# Altium schematic sheet IMX_Digital Interface Circuit.SchDoc
size A4; SheetNumber: 6; SheetTotal: 8
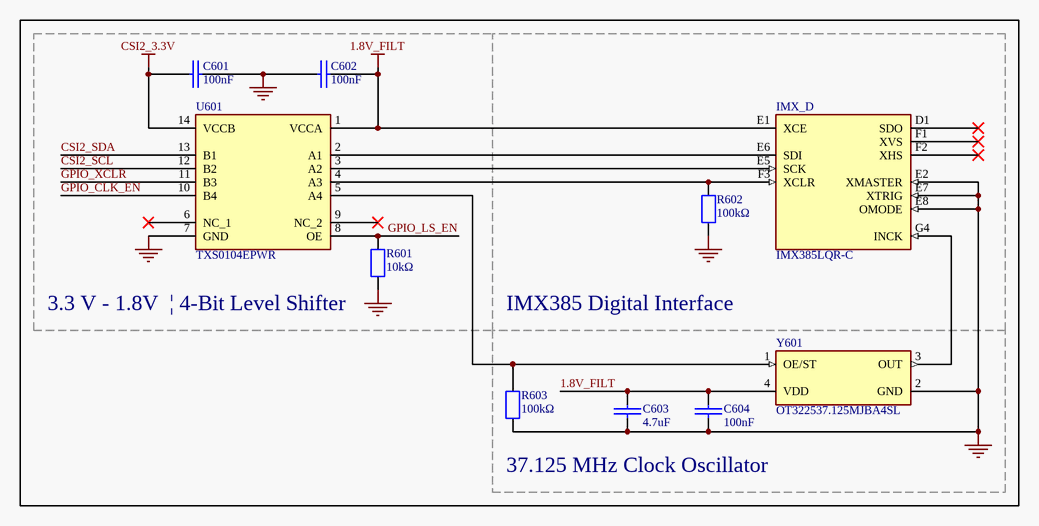
[diagram p0: IMX_Digital Interface Circuit.SchDoc]

## Parts
C601  100nF  [Capacitor, 0402]
C602  100nF  [Capacitor, 0402]
C603  4.7uF  [Capacitor, 0603]
C604  100nF  [Capacitor, 0402]
IMX_  IMX385LQR-C  [IMX385LQR]  (part D of 6)
R601  10kΩ  [Resistor, 0603, Yageo]
R602  100kΩ  [Resistor, 0603, Yageo]
R603  100kΩ  [Resistor, 0603, Yageo]
U601  TXS0104EPWR  [Level Shifter, 4-Bit]
Y601  OT322537.125MJBA4SL  [Clock Oscillator, 3235, 37.125]

## Nets
1.8V_FILT: C602.2 C603.1 C604.1 IMX_.E1(XCE) U601.1(VCCA) Y601.4(VDD)
CSI2_3.3V: C601.2 U601.14(VCCB)
GND: C601.1 C602.1 C603.2 C604.2 IMX_.E2(XMASTER) IMX_.E7(XTRIG) IMX_.E8(OMODE) R601.1 R602.1 R603.1 U601.7(GND) Y601.2(GND)
CSI2_SCL: U601.12(B2)
CSI2_SDA: U601.13(B1)
GPIO_CLK_EN: U601.10(B4)
GPIO_LS_EN: R601.2 U601.8(OE)
GPIO_XCLR: U601.11(B3)
NetIMX__E5: IMX_.E5(SCK) U601.3(A2)
NetIMX__E6: IMX_.E6(SDI) U601.2(A1)
NetIMX__F3: IMX_.F3(XCLR) R602.2 U601.4(A3)
NetIMX__G4: IMX_.G4(INCK) Y601.3(OUT)
NetR603_2: R603.2 U601.5(A4) Y601.1(OE/ST)

Not connected (* = marked no-connect by the designer): IMX_ D1(SDO)* F1(XVS)* F2(XHS)*; U601 6(NC_1)* 9(NC_2)*

## Notes on the sheet
- (near R601) 3.3 V - 1.8V  | 4-Bit Level Shifter
- IMX385 Digital Interface
- 37.125 MHz Clock Oscillator

## Library data of the parts
C601 C602 C604 = Capacitor, 0402, 100nF: Ceramic Capacitor, 16V, 10% +/- Tol, X7R, 0.1uF, SMD, 0402, #CL05B104KO5NNNC, JLC#C1525; Capacitance: 100nF
C603 = Capacitor, 0603, 4.7uF: Ceramic Capacitor, 10V, 10% +/- Tol, X7R, 4.7uF, SMD, 0603, #GRM188Z71A475KE15D, JLC#C913474; Capacitance: 4.7uF
IMX_ = IMX385LQR
R601 = Resistor, 0603, 10kΩ: Thick Film Resistor, ±1%, ±100ppm/℃, -55℃~+155℃, 0603, 10kΩ, #RC0603FR-0710KL, JLC#C98220
R602 R603 = Resistor, 0603, 100kΩ: Thick Film Resistor, ±1%, ±100ppm/℃, -55℃~+155℃, 0603, 100kΩ, #RC0603FR-07100KL, JLC#C14675
U601 = Level Shifter 4-Bit, Open Drain: 2.3V~5.5V 1 4 1.65V~3.6V 24Mbps TSSOP-14 Translators, Level Shifters ROHS, #TXS0104EPWR, JLC#C44955
Y601 = Clock Oscillator, SMD3225, 37.125Mhz: 1.8V~3.3V ±10ppm ±20ppm CMOS 37.125MHz SMD3225-4P Crystal Oscillators ROHS, JLC#C2831393